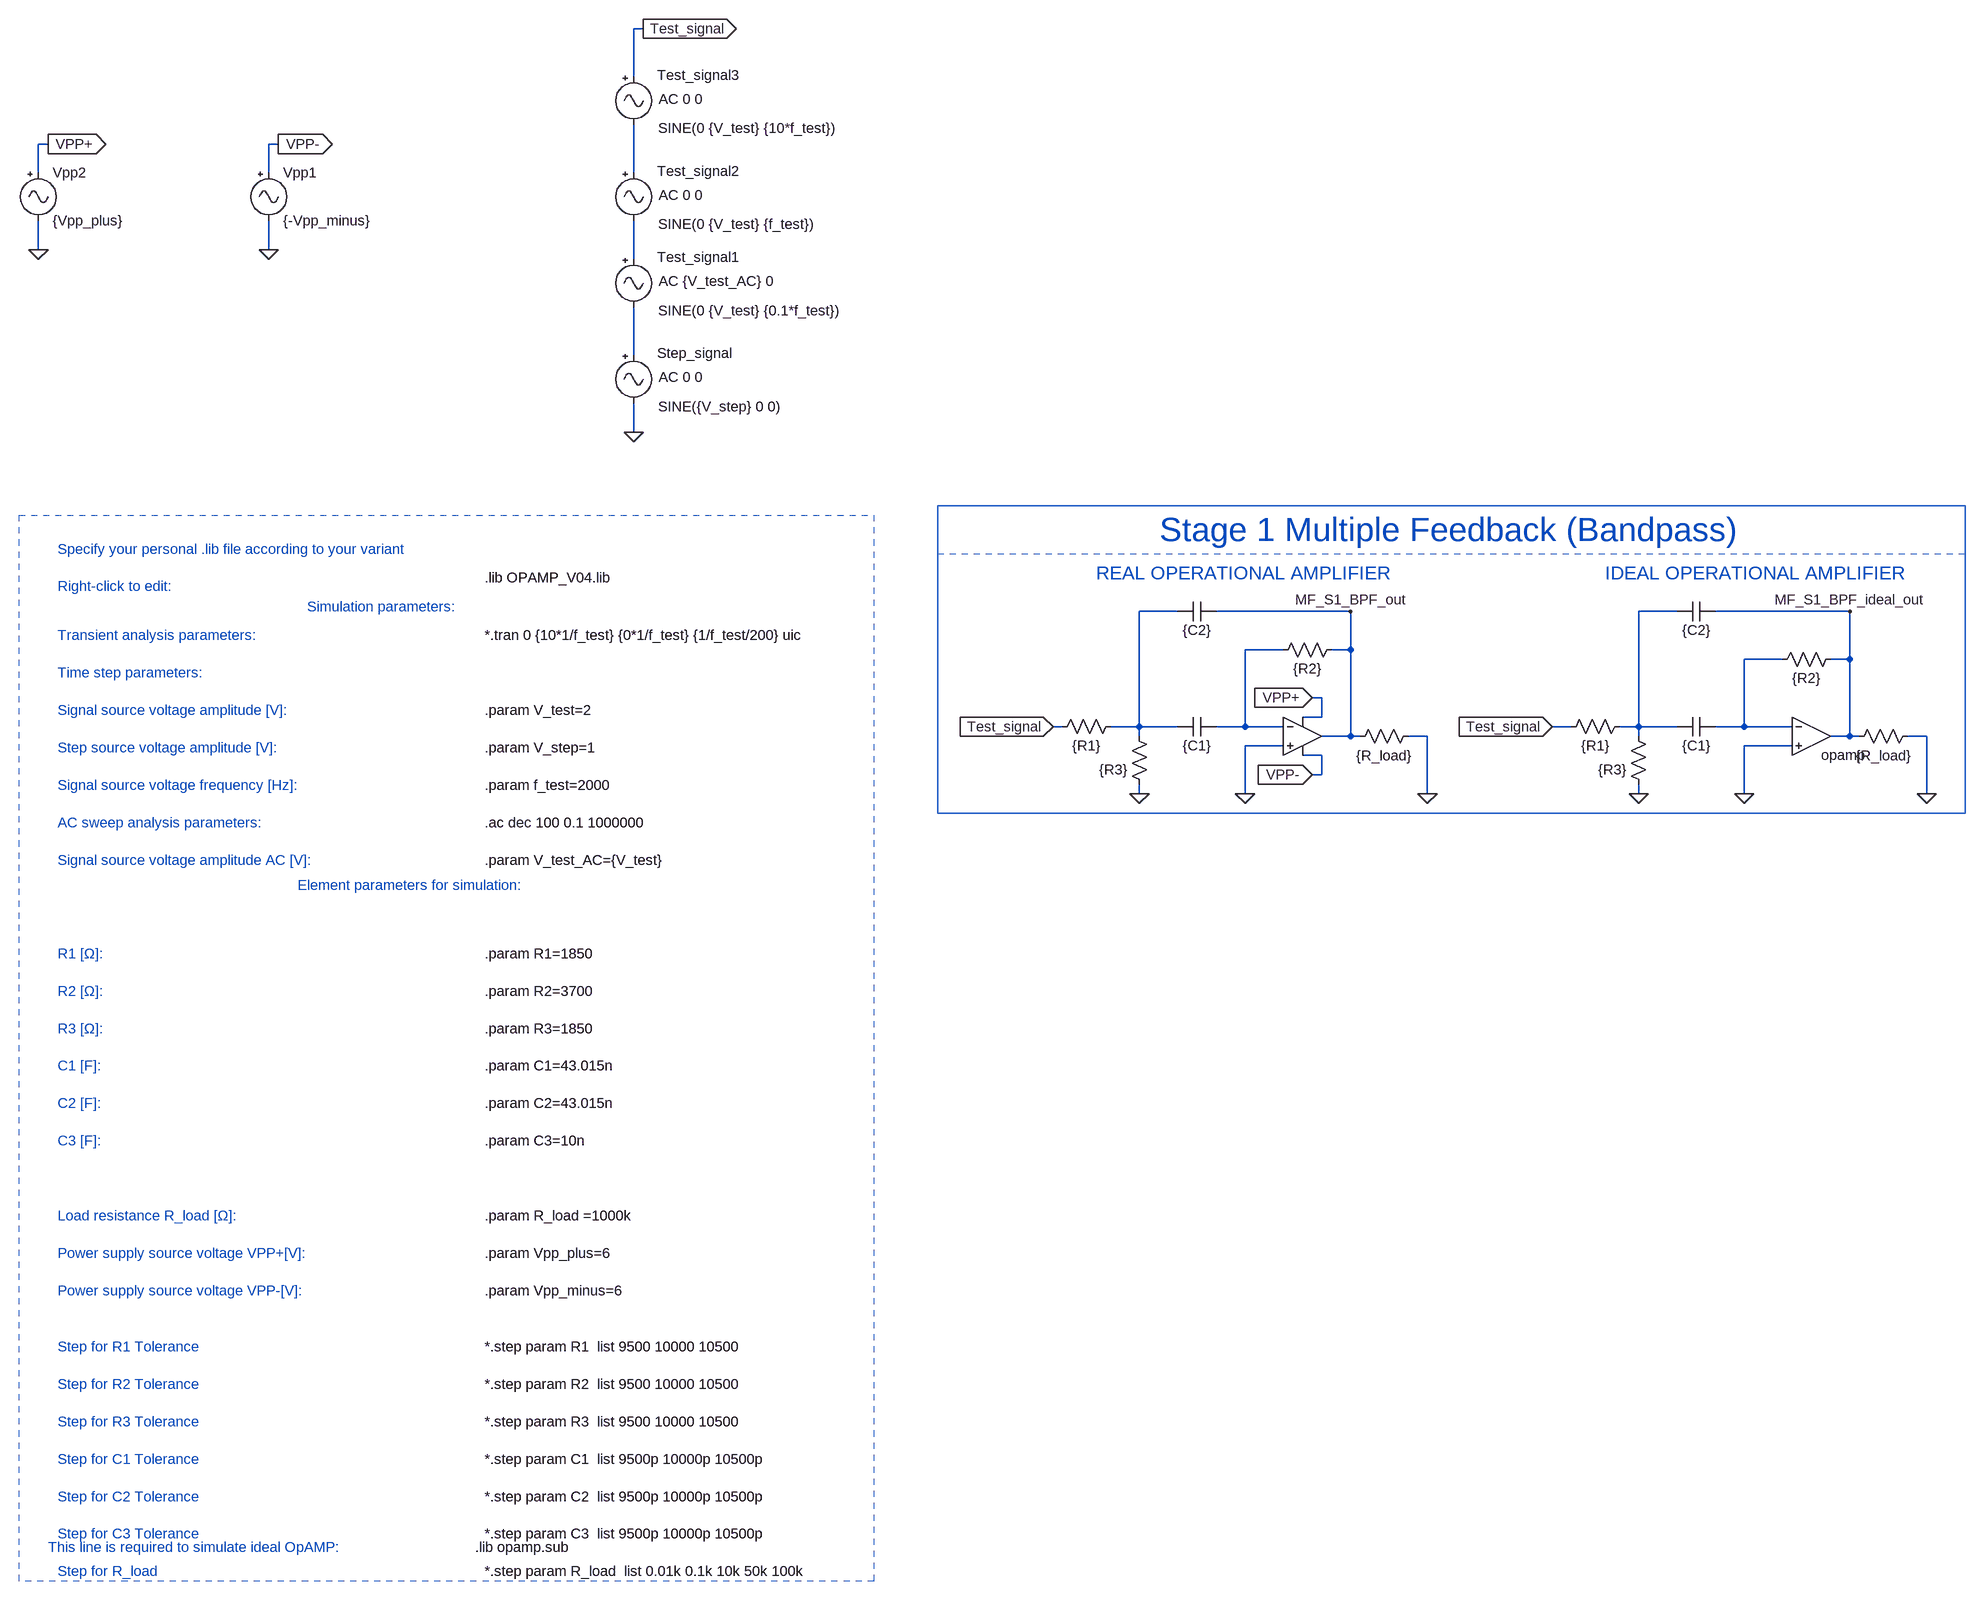
[diagram p0: schematic Practice 4 - Bandpass filters.asc]
Practice 4 - Bandpass filters.asc, the LTspice schematic file:
Version 4
SHEET 1 6772 2844
WIRE -1008 -1456 -1024 -1456
WIRE -1024 -1376 -1024 -1456
WIRE -2000 -1264 -2016 -1264
WIRE -1616 -1264 -1632 -1264
WIRE -2016 -1216 -2016 -1264
WIRE -1632 -1216 -1632 -1264
WIRE -1024 -1216 -1024 -1296
WIRE -2016 -1088 -2016 -1136
WIRE -1632 -1088 -1632 -1136
WIRE -1024 -1072 -1024 -1136
WIRE -1024 -912 -1024 -992
WIRE -1024 -784 -1024 -832
WIRE -32 -480 -96 -480
WIRE 256 -480 32 -480
WIRE 800 -480 736 -480
WIRE 1088 -480 864 -480
WIRE 144 -416 80 -416
WIRE 256 -416 256 -480
WIRE 256 -416 224 -416
WIRE 976 -400 912 -400
WIRE 1088 -400 1088 -480
WIRE 1088 -400 1056 -400
WIRE 208 -336 192 -336
WIRE 208 -304 208 -336
WIRE 208 -304 176 -304
WIRE -224 -288 -240 -288
WIRE -96 -288 -96 -480
WIRE -96 -288 -144 -288
WIRE -32 -288 -96 -288
WIRE 80 -288 80 -416
WIRE 80 -288 32 -288
WIRE 144 -288 80 -288
WIRE 624 -288 592 -288
WIRE 736 -288 736 -480
WIRE 736 -288 704 -288
WIRE 800 -288 736 -288
WIRE 912 -288 912 -400
WIRE 912 -288 864 -288
WIRE 992 -288 912 -288
WIRE -96 -272 -96 -288
WIRE 256 -272 256 -416
WIRE 256 -272 208 -272
WIRE 272 -272 256 -272
WIRE 384 -272 352 -272
WIRE 736 -272 736 -288
WIRE 1088 -272 1088 -400
WIRE 1088 -272 1056 -272
WIRE 1104 -272 1088 -272
WIRE 1216 -272 1184 -272
WIRE 144 -256 80 -256
WIRE 992 -256 912 -256
WIRE 208 -240 176 -240
WIRE 208 -208 208 -240
WIRE 208 -208 192 -208
WIRE -96 -176 -96 -192
WIRE 80 -176 80 -256
WIRE 384 -176 384 -272
WIRE 736 -176 736 -192
WIRE 912 -176 912 -256
WIRE 1216 -176 1216 -272
FLAG 80 -176 0
FLAG 192 -336 VPP+
IOPIN 192 -336 In
FLAG 192 -208 VPP-
IOPIN 192 -208 In
FLAG 256 -480 MF_S1_BPF_out
FLAG -240 -288 Test_signal
IOPIN -240 -288 In
FLAG 384 -176 0
FLAG -96 -176 0
FLAG 912 -176 0
FLAG 1088 -480 MF_S1_BPF_ideal_out
FLAG 592 -288 Test_signal
IOPIN 592 -288 In
FLAG 1216 -176 0
FLAG 736 -176 0
FLAG -2016 -1088 0
FLAG -1632 -1088 0
FLAG -2000 -1264 VPP+
IOPIN -2000 -1264 Out
FLAG -1616 -1264 VPP-
IOPIN -1616 -1264 Out
FLAG -1024 -784 0
FLAG -1008 -1456 Test_signal
IOPIN -1008 -1456 Out
SYMBOL OpAmps\\opamp2 176 -336 R0
WINDOW 0 16 32 Invisible 2
WINDOW 3 16 96 Invisible 2
SYMATTR InstName U13
SYMATTR Value OPAMP_VarNo
SYMBOL res -128 -304 R90
WINDOW 0 0 56 Invisible 2
WINDOW 3 32 56 VTop 2
SYMATTR InstName R21
SYMATTR Value {R1}
SYMATTR SpiceLine tol=10
SYMBOL res 128 -400 R270
WINDOW 0 32 56 Invisible 2
WINDOW 3 0 56 VBottom 2
SYMATTR InstName R22
SYMATTR Value {R2}
SYMBOL res 368 -288 R90
WINDOW 0 0 56 Invisible 2
WINDOW 3 33 56 VTop 2
SYMATTR InstName R23
SYMATTR Value {R_load}
SYMBOL cap 32 -304 R90
WINDOW 0 0 32 Invisible 2
WINDOW 3 32 32 VTop 2
SYMATTR InstName C10
SYMATTR Value {C1}
SYMBOL cap -32 -464 R270
WINDOW 0 32 32 Invisible 2
WINDOW 3 0 32 VBottom 2
SYMATTR InstName C11
SYMATTR Value {C2}
SYMBOL res 720 -304 R90
WINDOW 0 0 56 Invisible 2
WINDOW 3 32 56 VTop 2
SYMATTR InstName R25
SYMATTR Value {R1}
SYMATTR SpiceLine tol=10
SYMBOL res 960 -384 R270
WINDOW 0 32 56 Invisible 2
WINDOW 3 0 56 VBottom 2
SYMATTR InstName R26
SYMATTR Value {R2}
SYMBOL res 1200 -288 R90
WINDOW 0 0 56 Invisible 2
WINDOW 3 33 56 VTop 2
SYMATTR InstName R27
SYMATTR Value {R_load}
SYMBOL cap 864 -304 R90
WINDOW 0 0 32 Invisible 2
WINDOW 3 32 32 VTop 2
SYMATTR InstName C13
SYMATTR Value {C1}
SYMBOL cap 800 -464 R270
WINDOW 0 32 32 Invisible 2
WINDOW 3 0 32 VBottom 2
SYMATTR InstName C14
SYMATTR Value {C2}
SYMBOL OpAmps\\opamp 1024 -336 R0
WINDOW 0 0 32 Invisible 2
SYMATTR InstName U15
SYMBOL res -80 -176 R180
WINDOW 0 36 76 Invisible 2
WINDOW 3 36 40 Left 2
SYMATTR InstName Ri4
SYMATTR Value {R3}
SYMBOL res 752 -176 R180
WINDOW 0 36 76 Invisible 2
WINDOW 3 36 40 Left 2
SYMATTR InstName Ri5
SYMATTR Value {R3}
SYMBOL Misc\\signal -1024 -928 R0
WINDOW 123 42 53 Left 2
WINDOW 39 0 0 Left 0
WINDOW 0 39 13 Left 2
WINDOW 3 41 102 Left 2
SYMATTR Value2 AC 0 0
SYMATTR InstName Step_signal
SYMATTR Value SINE({V_step} 0 0)
SYMBOL Misc\\signal -1632 -1232 R0
WINDOW 123 0 0 Left 0
WINDOW 39 0 0 Left 0
SYMATTR InstName Vpp1
SYMATTR Value {-Vpp_minus}
SYMBOL Misc\\signal -2016 -1232 R0
WINDOW 123 0 0 Left 0
WINDOW 39 0 0 Left 0
SYMATTR InstName Vpp2
SYMATTR Value {Vpp_plus}
SYMBOL Misc\\signal -1024 -1232 R0
WINDOW 123 42 53 Left 2
WINDOW 39 0 0 Left 0
WINDOW 0 39 13 Left 2
WINDOW 3 41 102 Left 2
SYMATTR Value2 AC 0 0
SYMATTR InstName Test_signal2
SYMATTR Value SINE(0 {V_test} {f_test})
SYMBOL Misc\\signal -1024 -1392 R0
WINDOW 123 42 53 Left 2
WINDOW 39 0 0 Left 0
WINDOW 0 39 13 Left 2
WINDOW 3 41 102 Left 2
SYMATTR Value2 AC 0 0
SYMATTR InstName Test_signal3
SYMATTR Value SINE(0 {V_test} {10*f_test})
SYMBOL Misc\\signal -1024 -1088 R0
WINDOW 123 42 53 Left 2
WINDOW 39 0 0 Left 0
WINDOW 0 39 13 Left 2
WINDOW 3 41 102 Left 2
SYMATTR Value2 AC {V_test_AC} 0
SYMATTR InstName Test_signal1
SYMATTR Value SINE(0 {V_test} {0.1*f_test})
TEXT -1272 -440 Left 2 !*.tran 0 {10*1/f_test} {0*1/f_test} {1/f_test/200} uic\n \n \n \n.param V_test=2\n \n.param V_step=1\n \n.param f_test=2000\n \n.ac dec 100 0.1 1000000\n \n.param V_test_AC={V_test}\n \n \n  \n  \n.param R1=1850\n \n.param R2=3700\n \n.param R3=1850\n \n.param C1=43.015n\n \n.param C2=43.015n\n \n.param C3=10n\n \n \n \n.param R_load =1000k\n \n.param Vpp_plus=6\n \n.param Vpp_minus=6\n \n  \n*.step param R1  list 9500 10000 10500 \n \n*.step param R2  list 9500 10000 10500\n \n*.step param R3  list 9500 10000 10500\n \n*.step param C1  list 9500p 10000p 10500p\n \n*.step param C2  list 9500p 10000p 10500p\n \n*.step param C3  list 9500p 10000p 10500p\n \n*.step param R_load  list 0.01k 0.1k 10k 50k 100k
TEXT -1272 -536 Left 2 !.lib OPAMP_V04.lib
TEXT -1984 -584 Left 2 ;Specify your personal .lib file according to your variant\n \nRight-click to edit:
TEXT -1568 -488 Left 2 ;Simulation parameters:
TEXT -1584 -24 Left 2 ;Element parameters for simulation:
TEXT -1984 -440 Left 2 ;Transient analysis parameters:\n \nTime step parameters:\n \nSignal source voltage amplitude [V]:\n \nStep source voltage amplitude [V]:\n \nSignal source voltage frequency [Hz]:\n \nAC sweep analysis parameters:\n \nSignal source voltage amplitude AC [V]:\n  \n \n \n \nR1 [Ω]:\n \nR2 [Ω]:\n \nR3 [Ω]:\n \nC1 [F]:\n \nC2 [F]:\n \nC3 [F]:\n \n \n \nLoad resistance R_load [Ω]:\n \nPower supply source voltage VPP+[V]:\n \nPower supply source voltage VPP-[V]: \n \n \nStep for R1 Tolerance\n \nStep for R2 Tolerance\n \nStep for R3 Tolerance\n \nStep for C1 Tolerance \n \nStep for C2 Tolerance\n \nStep for C3 Tolerance \n \nStep for R_load
TEXT -1288 1080 Left 2 !.lib opamp.sub
TEXT -2000 1080 Left 2 ;This line is required to simulate ideal OpAMP:
TEXT 680 -544 Left 3 ;IDEAL OPERATIONAL AMPLIFIER
TEXT -168 -544 Left 3 ;REAL OPERATIONAL AMPLIFIER
TEXT 424 -616 Center 5 ;Stage 1 Multiple Feedback (Bandpass)
RECTANGLE Normal -624 1136 -2048 -640 2
RECTANGLE Normal 1280 -144 -432 -576 2
RECTANGLE Normal 1280 -144 -432 -656

The netlist it stands for:
* Practice 4 - Bandpass filters.asc
XU13 0 N006 VPP+ VPP- MF_S1_BPF_out OPAMP_VarNo  ; pins In+ In- V+ V- OUT
R21 N004 Test_signal {R1} tol=10
R22 N006 MF_S1_BPF_out {R2}
R23 0 MF_S1_BPF_out {R_load}
C10 N006 N004 {C1}
C11 N004 MF_S1_BPF_out {C2}
R25 N005 Test_signal {R1} tol=10
R26 N007 MF_S1_BPF_ideal_out {R2}
R27 0 MF_S1_BPF_ideal_out {R_load}
C13 N007 N005 {C1}
C14 N005 MF_S1_BPF_ideal_out {C2}
XU15 N007 0 MF_S1_BPF_ideal_out opamp Aol=100K GBW=10Meg  ; pins invin noninvin out
Ri4 0 N004 {R3}
Ri5 0 N005 {R3}
V§Step_signal N003 0 SINE({V_step} 0 0) AC 0 0
Vpp1 VPP- 0 {-Vpp_minus}
Vpp2 VPP+ 0 {Vpp_plus}
V§Test_signal2 N001 N002 SINE(0 {V_test} {f_test}) AC 0 0
V§Test_signal3 Test_signal N001 SINE(0 {V_test} {10*f_test}) AC 0 0
V§Test_signal1 N002 N003 SINE(0 {V_test} {0.1*f_test}) AC {V_test_AC} 0
*.tran 0 {10*1/f_test} {0*1/f_test} {1/f_test/200} uic
.param V_test=2
.param V_step=1
.param f_test=2000
.ac dec 100 0.1 1000000
.param V_test_AC={V_test}
.param R1=1850
.param R2=3700
.param R3=1850
.param C1=43.015n
.param C2=43.015n
.param C3=10n
.param R_load =1000k
.param Vpp_plus=6
.param Vpp_minus=6
*.step param R1  list 9500 10000 10500
*.step param R2  list 9500 10000 10500
*.step param R3  list 9500 10000 10500
*.step param C1  list 9500p 10000p 10500p
*.step param C2  list 9500p 10000p 10500p
*.step param C3  list 9500p 10000p 10500p
*.step param R_load  list 0.01k 0.1k 10k 50k 100k
.lib OPAMP_V04.lib
* Specify your personal .lib file according to your variant
* Right-click to edit:
* Simulation parameters:
* Element parameters for simulation:
* Transient analysis parameters:
* Time step parameters:
* Signal source voltage amplitude [V]:
* Step source voltage amplitude [V]:
* Signal source voltage frequency [Hz]:
* AC sweep analysis parameters:
* Signal source voltage amplitude AC [V]:
* R1 [Ω]:
* R2 [Ω]:
* R3 [Ω]:
* C1 [F]:
* C2 [F]:
* C3 [F]:
* Load resistance R_load [Ω]:
* Power supply source voltage VPP+[V]:
* Power supply source voltage VPP-[V]:
* Step for R1 Tolerance
* Step for R2 Tolerance
* Step for R3 Tolerance
* Step for C1 Tolerance
* Step for C2 Tolerance
* Step for C3 Tolerance
* Step for R_load
.lib opamp.sub
* This line is required to simulate ideal OpAMP:
* IDEAL OPERATIONAL AMPLIFIER
* REAL OPERATIONAL AMPLIFIER
* Stage 1 Multiple Feedback (Bandpass)
.backanno
.end